# Altium schematic sheet 5-Accelerometer.SchDoc
size A4
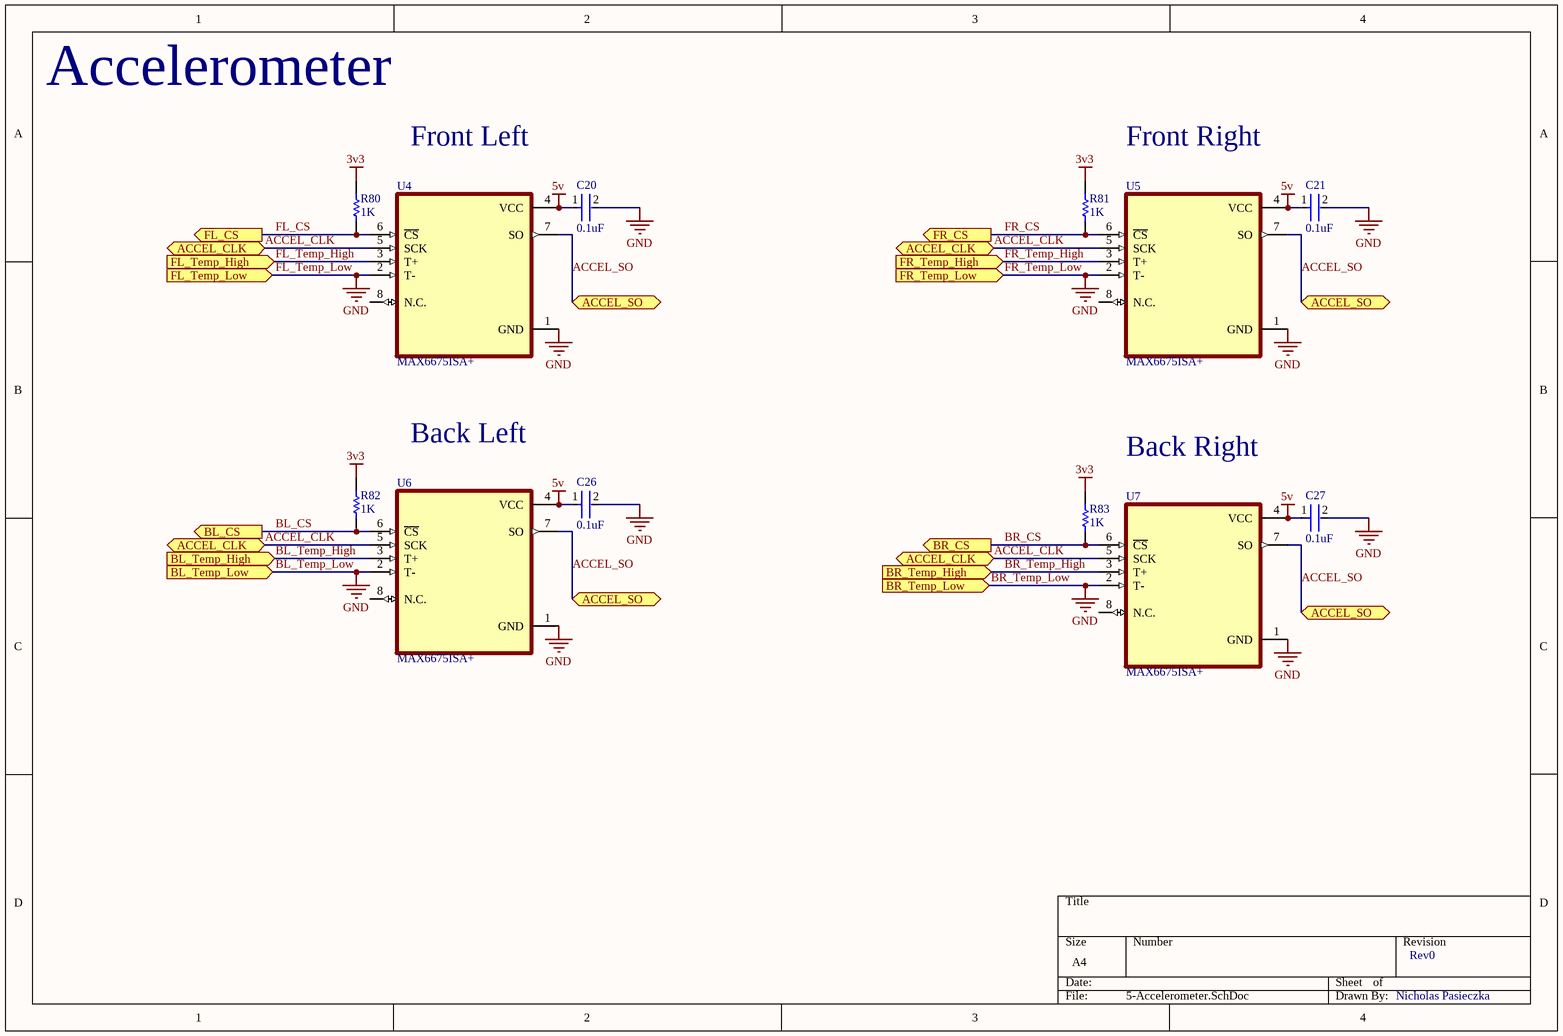
[diagram p0: 5-Accelerometer.SchDoc]

## Parts
C20  0.1uF  [FP-CL17-IPC_C]
C21  0.1uF  [FP-CL17-IPC_C]
C26  0.1uF  [FP-CL17-IPC_C]
C27  0.1uF  [FP-CL17-IPC_C]
R80  value 1K  [1608[0603]]  (hidden comment: Res1)
R81  value 1K  [1608[0603]]  (hidden comment: Res1)
R82  value 1K  [1608[0603]]  (hidden comment: Res1)
R83  value 1K  [1608[0603]]  (hidden comment: Res1)
U4  MAX6675ISA+  [SOIC127P600X175-8N]
U5  MAX6675ISA+  [SOIC127P600X175-8N]
U6  MAX6675ISA+  [SOIC127P600X175-8N]
U7  MAX6675ISA+  [SOIC127P600X175-8N]

## Ports
ACCEL_CLK (bidir), ACCEL_SO (bidir), BL_CS (out), BL_Temp_High (in), BL_Temp_Low (in), BR_CS (out), BR_Temp_High (in), BR_Temp_Low (in), FL_CS (out), FL_Temp_High (in), FL_Temp_Low (in), FR_CS (out), FR_Temp_High (in), FR_Temp_Low (in)

## Nets
3v3: R80.2 R81.2 R82.2 R83.2
5v: C20.1 C21.1 C26.1 C27.1 U4.4(VCC) U5.4(VCC) U6.4(VCC) U7.4(VCC)
BL_Temp_Low: C20.2 C21.2 C26.2 C27.2 U4.1(GND) U4.2(T-) U5.1(GND) U5.2(T-) U6.1(GND) U6.2(T-) U7.1(GND) U7.2(T-) ; port FL_Temp_Low, port BL_Temp_Low, port BR_Temp_Low, port FR_Temp_Low  [also labelled BR_Temp_Low, FL_Temp_Low, FR_Temp_Low, GND]
ACCEL_CLK: U4.5(SCK) U5.5(SCK) U6.5(SCK) U7.5(SCK) ; port ACCEL_CLK
ACCEL_SO: U4.7(SO) U5.7(SO) U6.7(SO) U7.7(SO) ; port ACCEL_SO
BL_CS: R82.1 U6.6(~{CS}) ; port BL_CS
BL_Temp_High: U6.3(T+) ; port BL_Temp_High
BR_CS: R83.1 U7.6(~{CS}) ; port BR_CS
BR_Temp_High: U7.3(T+) ; port BR_Temp_High
FL_CS: R80.1 U4.6(~{CS}) ; port FL_CS
FL_Temp_High: U4.3(T+) ; port FL_Temp_High
FR_CS: R81.1 U5.6(~{CS}) ; port FR_CS
FR_Temp_High: U5.3(T+) ; port FR_Temp_High

Not connected (* = marked no-connect by the designer): U4 8(N.C.); U5 8(N.C.); U6 8(N.C.); U7 8(N.C.)

## Notes on the sheet
- Accelerometer
- Front Left
- Front Right
- Back Left
- Back Right
- Rev0
- Nicholas Pasieczka

## Library data of the parts
C20 C21 C26 C27 = CMP-13271-001069-1: Cap Ceramic 100nF 10V X7R ±10% SMD 0402 +125°C Paper T/R; Height: 0.5mm; Case/Package: 0402; Contact Plating: Tin; Case Code (Imperial): 0402; Capacitance: 100nF; Thickness: 0.022inch; Min Operating Temperature: -55°C; Package Quantity: 1; Length: 1mm; Max Operating Temperature: 125°C; Depth: 0.5mm; Voltage Rating: 10V; Packaging: Tape and Reel; Mount: Surface Mount; Tolerance: 10%; Width: 0.02inch; Radiation Hardening: No; Case Code (Metric): 1005; Dielectric: X7R
R80-R83 = Res1: Resistor; Published: 8-Jun-2000; LatestRevisionDate: 17-Jul-2002; LatestRevisionNote: Re-released for DXP Platform.; PackageReference: AXIAL-0.3; Publisher: Altium Limited; PackageDescription: Axial Device, Thru-Hole; 2 Leads; 0.3 in Pin Spacing
U4-U7 = MAX6675ISA+: IC THERMOCOUP TO DGTL 8-SOIC; MF: Maxim Integrated; Package: SOIC-8 Maxim; Price: None; SnapEDA_Link: https://www.snapeda.com/parts/MAX6675ISA%2B/Maxim%20Integrated/view-part/213937/?ref=snap; Availability: Unavailable; Value: *; MP: MAX6675ISA+